# Altium project Quadcopter.PrjPCB
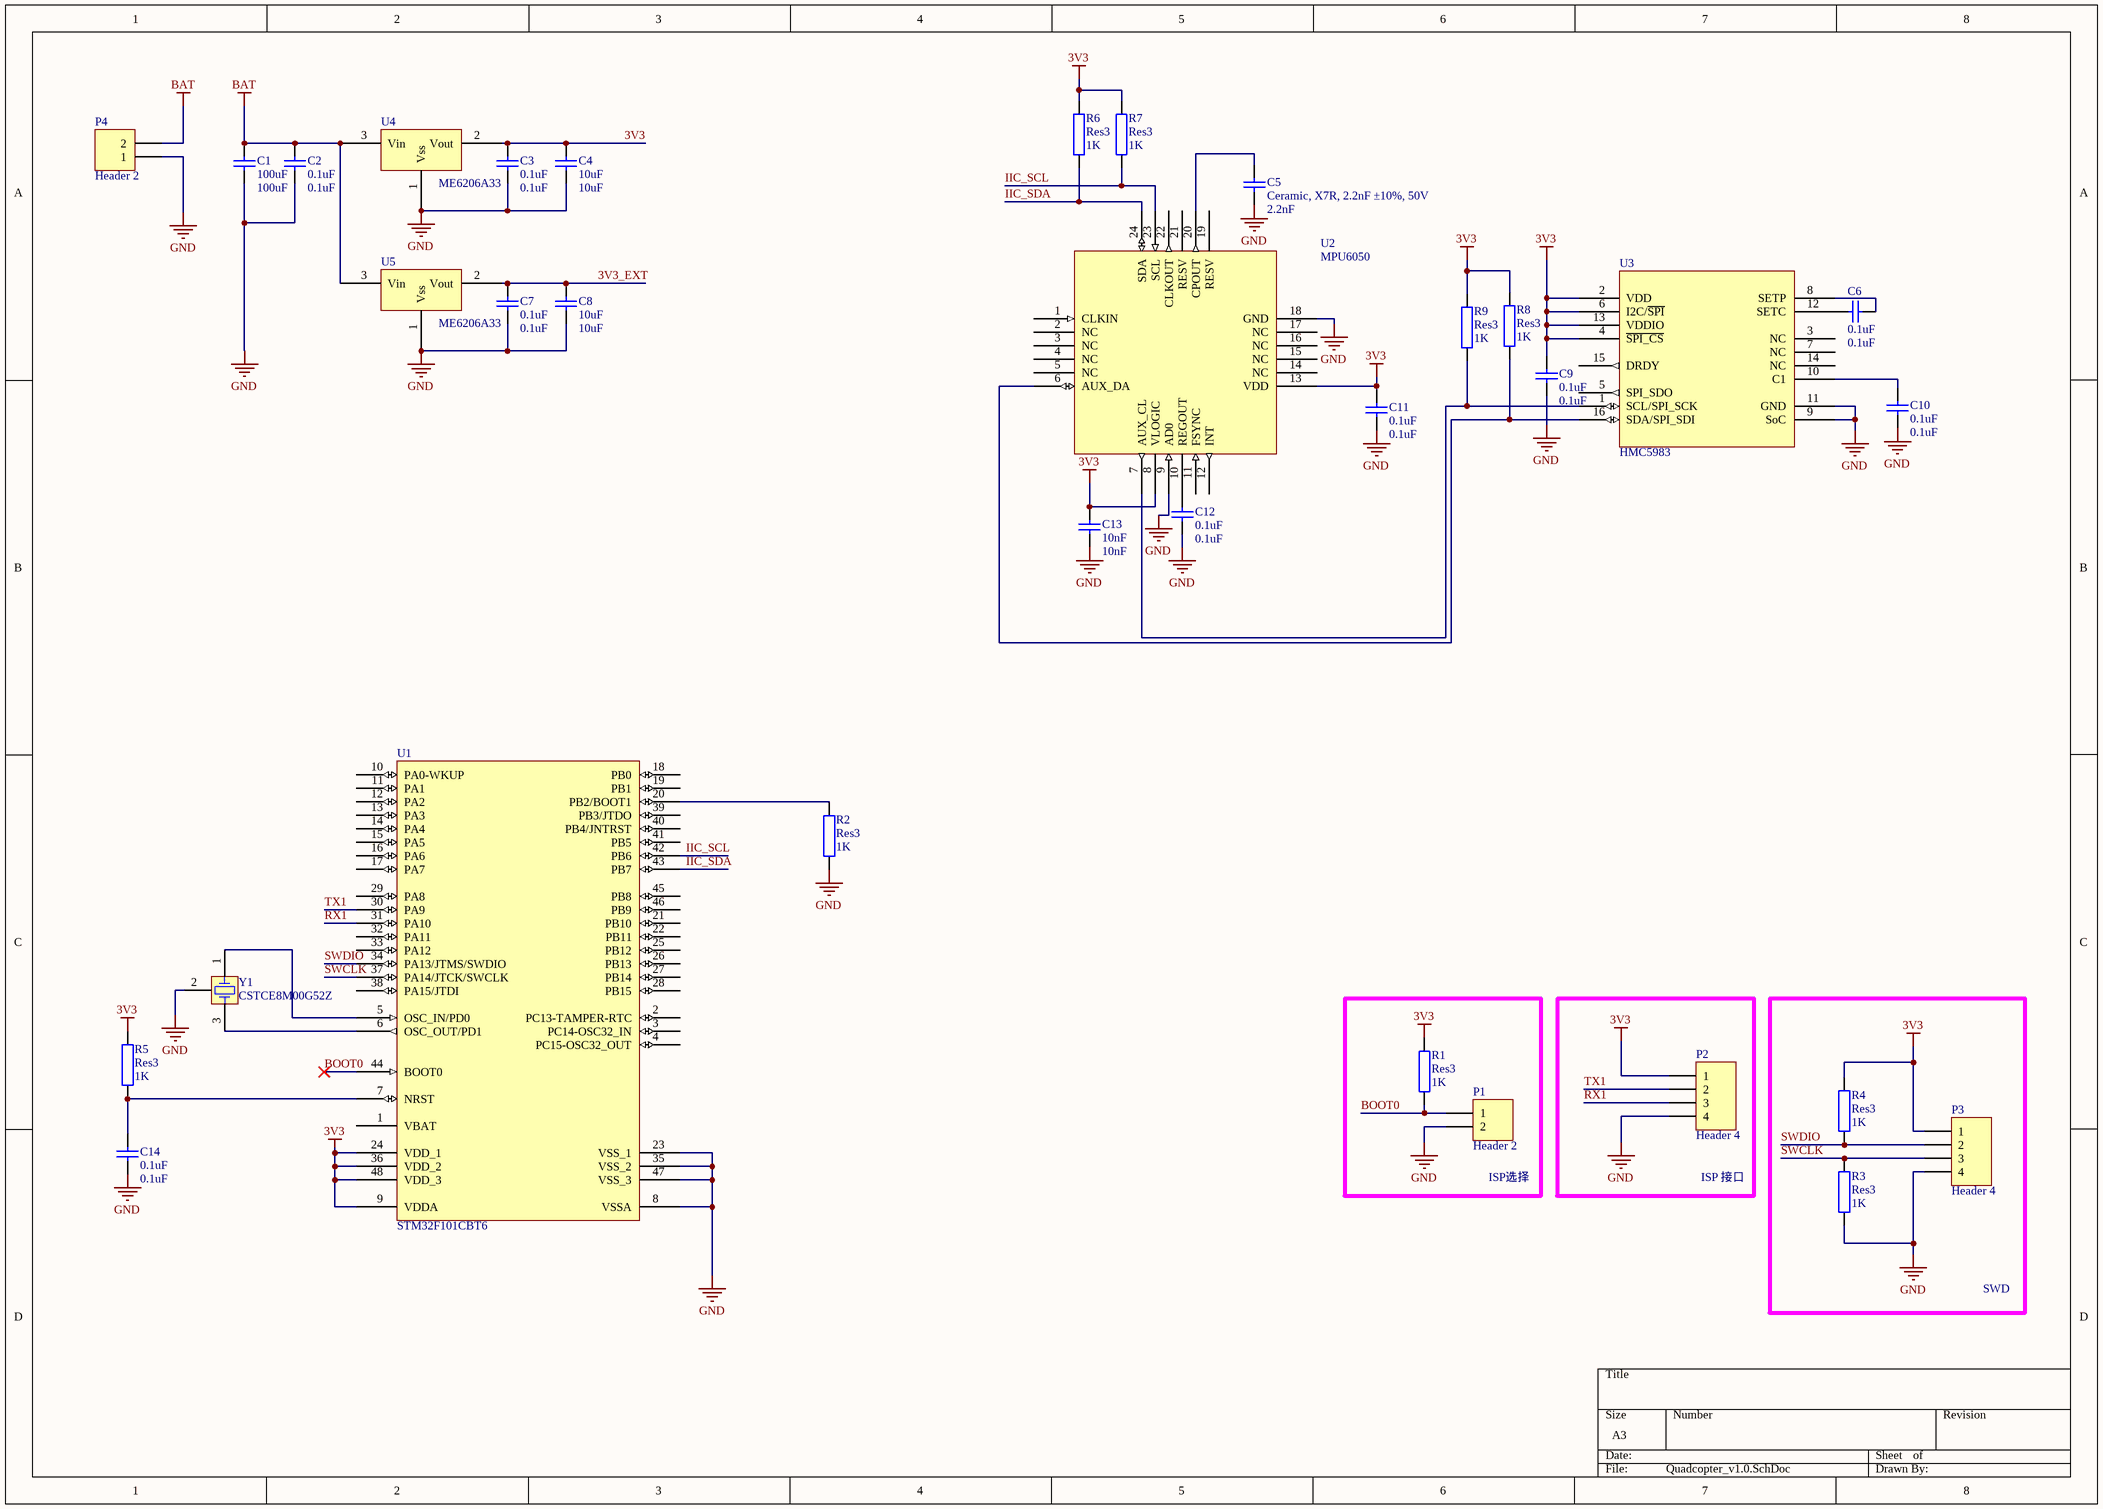
[diagram p0: Quadcopter_v1.0.SchDoc]
1 sheet, 33 parts. Net scope: global (net labels, ports and power ports of the same name join across sheets).
Board file: Quadcopter_v1.0.PcbDoc

## Sheet Quadcopter_v1.0.SchDoc
size A3; PageSetup: Record=PageOptions|CenterHorizontal=True|CenterVertical=True|PrintScale=1.00|XCorrection=1.00|YCorrection=1.00|PrintKind=1|BorderSize=5000000|LeftOffset=0|BottomOffset=0|Orientation=2|PaperLength=1000|PaperWidth=1000|Scale=100|PaperSource=7|PrintQuality=-3|MediaType=1|DitherType=10|PrintScaleMode=1|PaperKind=A3|PaperIndex=8

### Parts
C1  100uF  [c0805]
C2  0.1uF  [c0805]
C3  0.1uF  [c0805]
C4  10uF  [c0805]
C5  Ceramic, X7R, 2.2nF ±10%, 50V  value 2.2nF  [c0805]
C6  0.1uF  [c0805]
C7  0.1uF  [c0805]
C8  10uF  [c0805]
C9  0.1uF  [C1206]
C10  0.1uF  [C1206]
C11  0.1uF  [c0805]
C12  0.1uF  [c0805]
C13  10nF  [c0805]
C14  0.1uF  [C1206]
P1  Header 2  [HDR1X2]
P2  Header 4  [HDR1X4]
P3  Header 4  [HDR1X4]
P4  Header 2  [HDR1X2]
R1  Res3  value 1K  [r0603]
R2  Res3  value 1K  [r0603]
R3  Res3  value 1K  [r0603]
R4  Res3  value 1K  [r0603]
R5  Res3  value 1K  [r0603]
R6  Res3  value 1K  [r0603]
R7  Res3  value 1K  [r0603]
R8  Res3  value 1K  [r0603]
R9  Res3  value 1K  [r0603]
U1  STM32F101CBT6  [LQFP48_N]
U2  MPU6050  [24 Lead QFN]
U3  HMC5983  [16 Lead QFN 2]
U4  ME6206A33  [SOT 23]
U5  ME6206A33  [SOT 23]
Y1  CSTCE8M00G52Z  [X8MCSTCR]

### Blocks framed on the sheet
ISP选择: P1 R1
ISP 接口: P2
SWD: P3 R3 R4

### Nets
3V3: C3.2 C4.2 C9.2 C11.2 C13.2 P2.1 P3.1 R1.2 R4.2 R5.1 R6.2 R7.2 R8.2 R9.2 U1.9(VDDA) U1.24(VDD_1) U1.36(VDD_2) U1.48(VDD_3) U2.8(VLOGIC) U2.13(VDD) U3.2(VDD) U3.4(~{SPI_CS}) U3.6(I2C/~{SPI}) U3.13(VDDIO) U4.2(Vout)
BAT: C1.2 C2.2 P4.2 U4.3(Vin) U5.3(Vin)
GND: C1.1 C2.1 C3.1 C4.1 C5.1 C7.1 C8.1 C9.1 C10.1 C11.1 C12.1 C13.1 C14.1 P1.2 P2.4 P3.4 P4.1 R2.1 R3.1 U1.8(VSSA) U1.23(VSS_1) U1.35(VSS_2) U1.47(VSS_3) U2.9(AD0) U2.18(GND) U3.9(SoC) U3.11(GND) U4.1(Vss) U5.1(Vss) Y1.2(COM)
3V3_EXT: C7.2 C8.2 U5.2(Vout)
BOOT0: P1.1 R1.1 U1.44(BOOT0)
IIC_SCL: R7.1 U1.42(PB6) U2.23(SCL)
IIC_SDA: R6.1 U1.43(PB7) U2.24(SDA)
RX1: P2.3 U1.31(PA10)
SWCLK: P3.3 R3.2 U1.37(PA14/JTCK/SWCLK)
SWDIO: P3.2 R4.1 U1.34(PA13/JTMS/SWDIO)
TX1: P2.2 U1.30(PA9)
NetC5_2: C5.2 U2.20(CPOUT)
NetC6_1: C6.1 U3.8(SETP)
NetC6_2: C6.2 U3.12(SETC)
NetC10_2: C10.2 U3.10(C1)
NetC12_2: C12.2 U2.10(REGOUT)
NetC14_2: C14.2 R5.2 U1.7(NRST)
NetR2_2: R2.2 U1.20(PB2/BOOT1)
NetR8_1: R8.1 U2.6(AUX_DA) U3.16(SDA/SPI_SDI)
NetR9_1: R9.1 U2.7(AUX_CL) U3.1(SCL/SPI_SCK)
NetU1_5: U1.5(OSC_IN/PD0) Y1.1(OSC1)
NetU1_6: U1.6(OSC_OUT/PD1) Y1.3(OSC2)

Not connected (* = marked no-connect by the designer): U1 1(VBAT) 2(PC13-TAMPER-RTC) 3(PC14-OSC32_IN) 4(PC15-OSC32_OUT) 10(PA0-WKUP) 11(PA1) 12(PA2) 13(PA3) 14(PA4) 15(PA5) 16(PA6) 17(PA7) 18(PB0) 19(PB1) 21(PB10) 22(PB11) 25(PB12) 26(PB13) 27(PB14) 28(PB15) 29(PA8) 32(PA11) 33(PA12) 38(PA15/JTDI) 39(PB3/JTDO) 40(PB4/JNTRST) 41(PB5) 45(PB8) 46(PB9); U2 1(CLKIN) 2(NC) 3(NC) 4(NC) 5(NC) 11(FSYNC) 12(INT) 14(NC) 15(NC) 16(NC) 17(NC) 19(RESV) 21(RESV) 22(CLKOUT); U3 3(NC) 5(SPI_SDO) 7(NC) 14(NC) 15(DRDY)

### Library data of the parts
C1-C5 C7 C8 C11-C13 = Cap Semi: Capacitor (Semiconductor SIM Model); Published: 8-Jun-2000; LatestRevisionDate: 29-May-2009; LatestRevisionNote: IPC-7351 Footprint Added.; PackageReference: C1206; Publisher: Altium Limited; PackageDescription: Chip Capacitor
  C1: Value: 100uF
  C2 C3 C7 C11 C12: Value: 0.1uF
  C4 C8: Value: 10uF
  C13: Value: 10nF
C6 C9 C10 C14 = Cap: Capacitor (Semiconductor SIM Model); Published: 8-Jun-2000; LatestRevisionDate: 29-May-2009; LatestRevisionNote: IPC-7351 Footprint Added.; PackageReference: C1206; Publisher: Altium Limited; PackageDescription: Chip Capacitor; Value: 0.1uF
P1 P4 = Header 2: Header, 2-Pin; LatestRevisionDate: 17-Jul-2002; LatestRevisionNote: Re-released for DXP Platform.; Publisher: Altium Limited
P2 P3 = Header 4: Header, 4-Pin; LatestRevisionDate: 17-Jul-2002; LatestRevisionNote: Re-released for DXP Platform.; Publisher: Altium Limited
R1-R9 = Res3: Resistor; Published: 8-Jun-2000; LatestRevisionDate: 29-May-2009; LatestRevisionNote: IPC-7351 Footprint Added.; PackageReference: J1-0603; Publisher: Altium Limited; PackageDescription: Chip Resistor
U1 = STM32F101CBT6: STM32 ARM-based 32-bit MCU with 128 Kbytes Flash, 48-pin LQFP, Industrial Temperature; Published: 30-May-2008; DatasheetVersion: rev6, Mar-2008; PackageVersion: Mar-2008; PackageReference: LQFP48; Publisher: Altium Limited; PackageDescription: 48-Pin Low-Profile Quad Flat Pack, 7 x 7 mm Body, 0.5 mm Pitch (LQFP48); ComponentLink1Description: Manufacturer Link; ComponentLink1URL: www.st.com/stm32; ComponentLink2Description: Datasheet; ComponentLink2URL: http://www.st.com/stonline/products/literature/ds/13586.pdf
U2 = MPU6050: MPU6050, 24pin
U3 = HMC5983: HMC5983, 16pin
U4 U5 = ME6206: ME6206A33, SOT23
Y1 = CSTCE8M00G52Z: Crystal Oscillator, 3rd In-Line Lead Version